# EasyEDA schematic SCH_BlackRacer_team.json
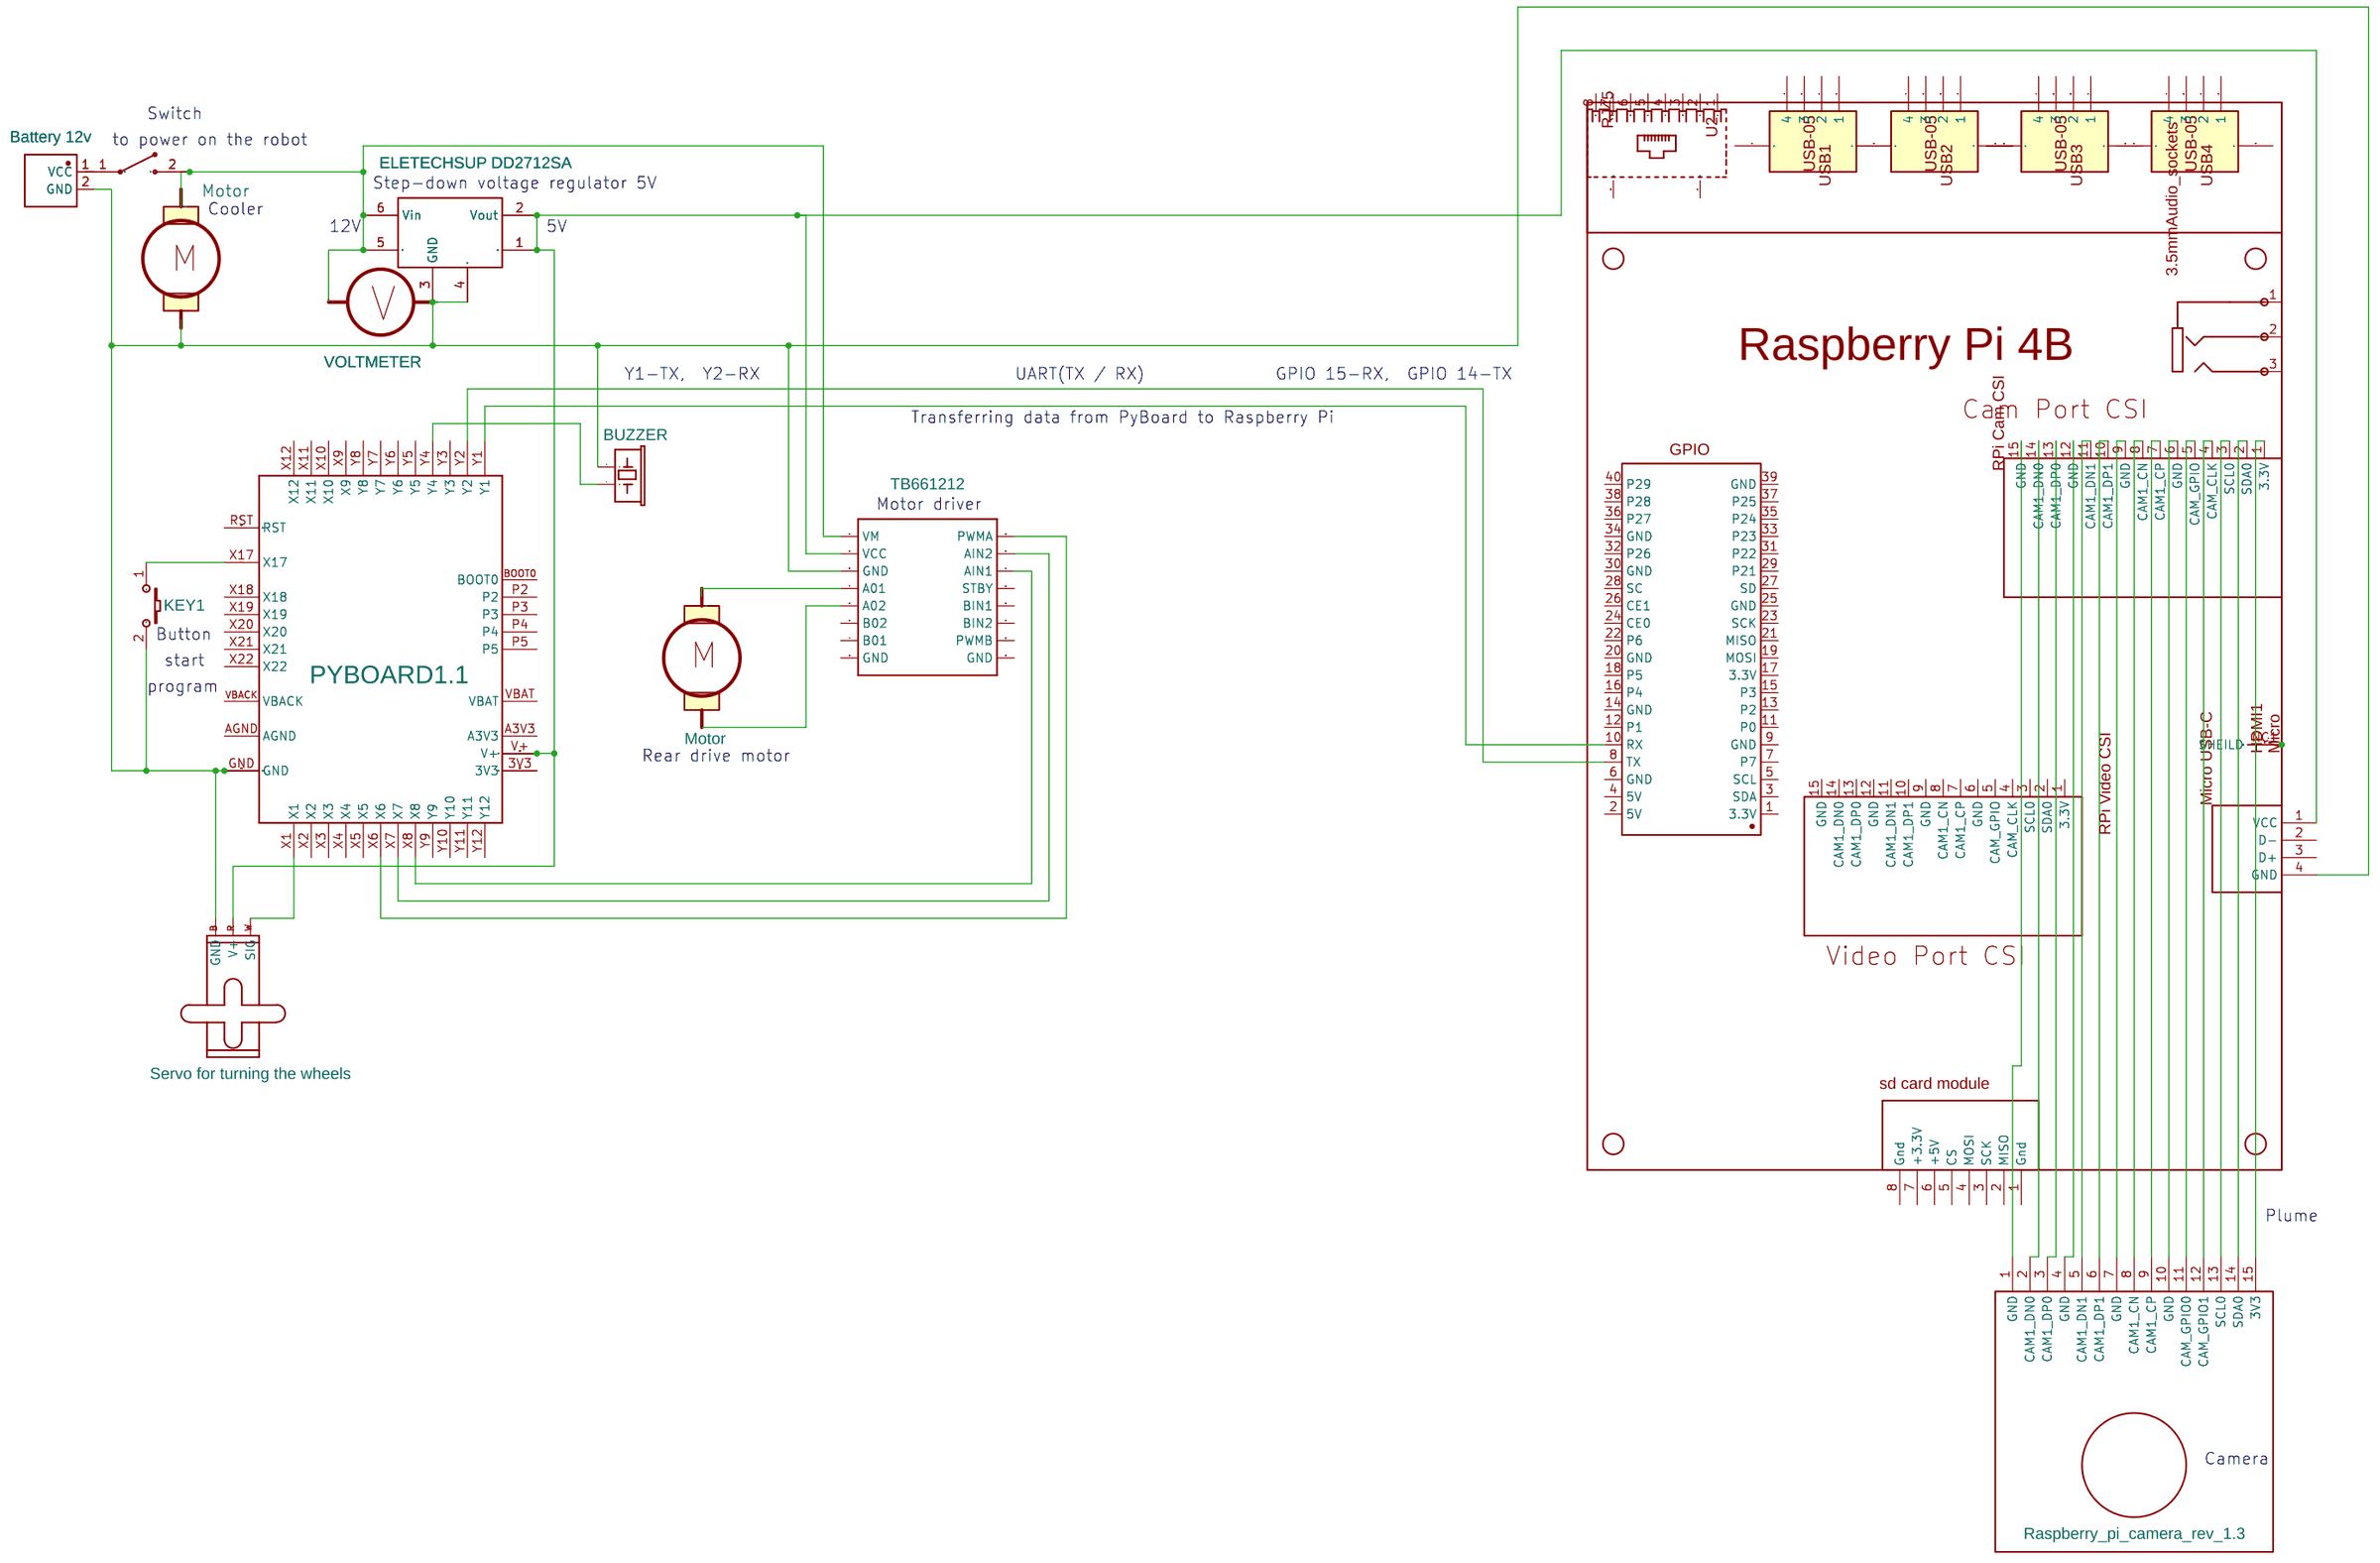
[diagram p0: schematic sheet]

## Parts
1  PYBOARD1.1  [PYBOARD]
KEY1  K2-3.6×6.1_SMD  [KEY-SMD_2P-L6.2-W3.6-LS8.0]
M1  Servo for turning the wheels  [1X03]
M2  Motor
M4  Motor
P1  VOLTMETER  [2PIN]
SG1  BUZZER  [BUZZER-12MM-NS-KIT]
U1  ELETECHSUP DD2712SA  [DD2712SA]
U3  RaspberryPi4SpiceFile
U4  Battery 12v
U5  Raspberry_pi_camera_rev_1.3
U7  Botton
U9  TB661212  [DUAL TB6612FNG]

## Library data of the parts
1 = PYBOARD1.1: Contributor: Ben Howard
KEY1 = K2-3.6×6.1_SMD: Supplier Part: C118141; Supplier: LCSC; Manufacturer Part: K2-1107ST-A4SW-06; Contributor: LCEDA_Lib; 制造商: 韩国韩荣
M1 = SERVO: Contributor: ZegesMenden
M2 M4 = motor
P1 = VOLTMETER_XL
SG1 = BUZZER: Contributor: SparkFun
U1 = DD2712SA: Manufacturer: eletechsup; Supplier: Aliexpress; link: https://aliexpress.com/item/32817933017.html; Contributor: nivie
U3 = RaspberryPi4SpiceFile: catid: 20; Contributor: leorprod; sim: true
U4 = Battery: Contributor: greandotcom
U5 = Raspberry_pi_camera_rev_1.3: Contributor: MiDem
U7 = Botton: Manufacturer: RSB; Manufacturer Part: 2A080; Supplier Part: 12131; Contributor: Krusad
U9 = TB661212: TB6612 The TB6612FNG motor driver can control up to two DC motors at a constant current of 1.2A (3.2A peak).; Contributor: 陳文豪

## Nets
Net-(1-3V3): 1.3V3 1.3V3-1(3V3)
Net-(1-GND): 1.GND 1.GND0(GND) 1.GND1(GND) 1.GND2(GND) 1.GND3(GND) 1.GND4(GND) 1.GND5(GND) 1.GND6(GND) KEY1.2 M1.3(GND) P1.2(B) SG1.+(1) U1.3(GND) U1.4(GND) U3.4(5V) U4.2(GND) U5.12(CAM_GPIO1) U9.GND
Net-(1-RST): 1.RST 1.RST1(RST)
Net-(1-V+): 1.V+ 1.V+1(V+) 1.V+2(V+) 1.V+3(V+) 1.V+4(V+) 1.V+5(V+) 1.V+6(V+) M1.2(V+) U1.1(Vout) U1.2(Vout) U3.1(3.3V) U5.15(3V3) U9.VCC
Net-(1-X1): 1.X1 M1.1(SIG)
Net-(1-X6): 1.X6 U9.16(PWMA)
Net-(1-X7): 1.X7 U9.15(AIN2)
Net-(1-X8): 1.X8 U9.14(AIN1)
Net-(1-X17): 1.X17 KEY1.1
Net-(1-Y1): 1.Y1 U3.10(RX) U5.6(CAM1_DP1)
Net-(1-Y2): 1.Y2 U3.8(TX) U5.8(CAM1_CN)
Net-(1-Y4): 1.Y4 SG1.-(2)
Net-(M2-2): M2.2 P1.1(A) U1.5(Vin) U1.6(Vin) U7.2(1) U9.VM
Net-(U3-2): U3.2(5V) U5.14(SDA0)
Net-(U3-3): U3.3(SDA) U5.13(SCL0)
Net-(U3-5): U3.5(SCL) U5.11(CAM_GPIO0)
Net-(U3-6): U3.6(GND) U5.10(GND)
Net-(U3-7): U3.7(P7) U5.9(CAM1_CP)
Net-(U3-9): U3.9(GND) U5.7(GND)
Net-(U3-11): U3.11(P0) U5.5(CAM1_DN1)
Net-(U3-12): U3.12(P1) U5.4(GND)
Net-(U3-13): U3.13(P2) U5.3(CAM1_DP0)
Net-(U3-14): U3.14(GND) U5.2(CAM1_DN0)
Net-(U3-15): U3.15(P3) U5.1(GND)
Net-(U3-NC1): U3.NC1(SHEILD) U3.NC2(SHEILD) U3.NC3(SHEILD) U3.NC4(SHEILD)

Not connected (* = marked no-connect by the designer): 1 A3V3 AGND BOOT0 P2 P3 P4 P5 VBACK VBAT X2 X3 X4 X5 X9 X10 X11 X12 X18 X19 X20 X21 X22 Y3 Y5 Y6 Y7 Y8 Y9 Y10 Y11 Y12; M4 2; U3 0 16(P4) 17(3.3V) 18(P5) 19(MOSI) 20(GND) 21(MISO) 22(P6) 23(SCK) 24(CE0) 25(GND) 26(CE1) 27(SD) 28(SC) 29(P21) 30(GND) 31(P22) 32(P26) 33(P23) 34(GND) 35(P24) 36(P27) 37(P25) 38(P28) 39(GND) 40(P29) S1(CASE1) S2(CASE2); U4 1(VCC); U7 1(2); U9 4(A01) 5(A02) 6(B02) 7(B01) 8(GND) 10(PWMB) 11(BIN2) 12(BIN1) 13(STBY) 56(GND)

## Notes on the sheet
- Switch
- to power on the robot
- Step-down voltage regulator 5V
- Cooler
- 12V
- 5V
- Y1-TX,  Y2-RX
- UART(TX / RX)
- GPIO 15-RX,  GPIO 14-TX
- Transferring data from PyBoard to Raspberry Pi
- Motor driver
- Button
- start
- program
- Rear drive motor
- Plume
- Camera
